# Altium schematic sheet Sheet1.SchDoc
size A1
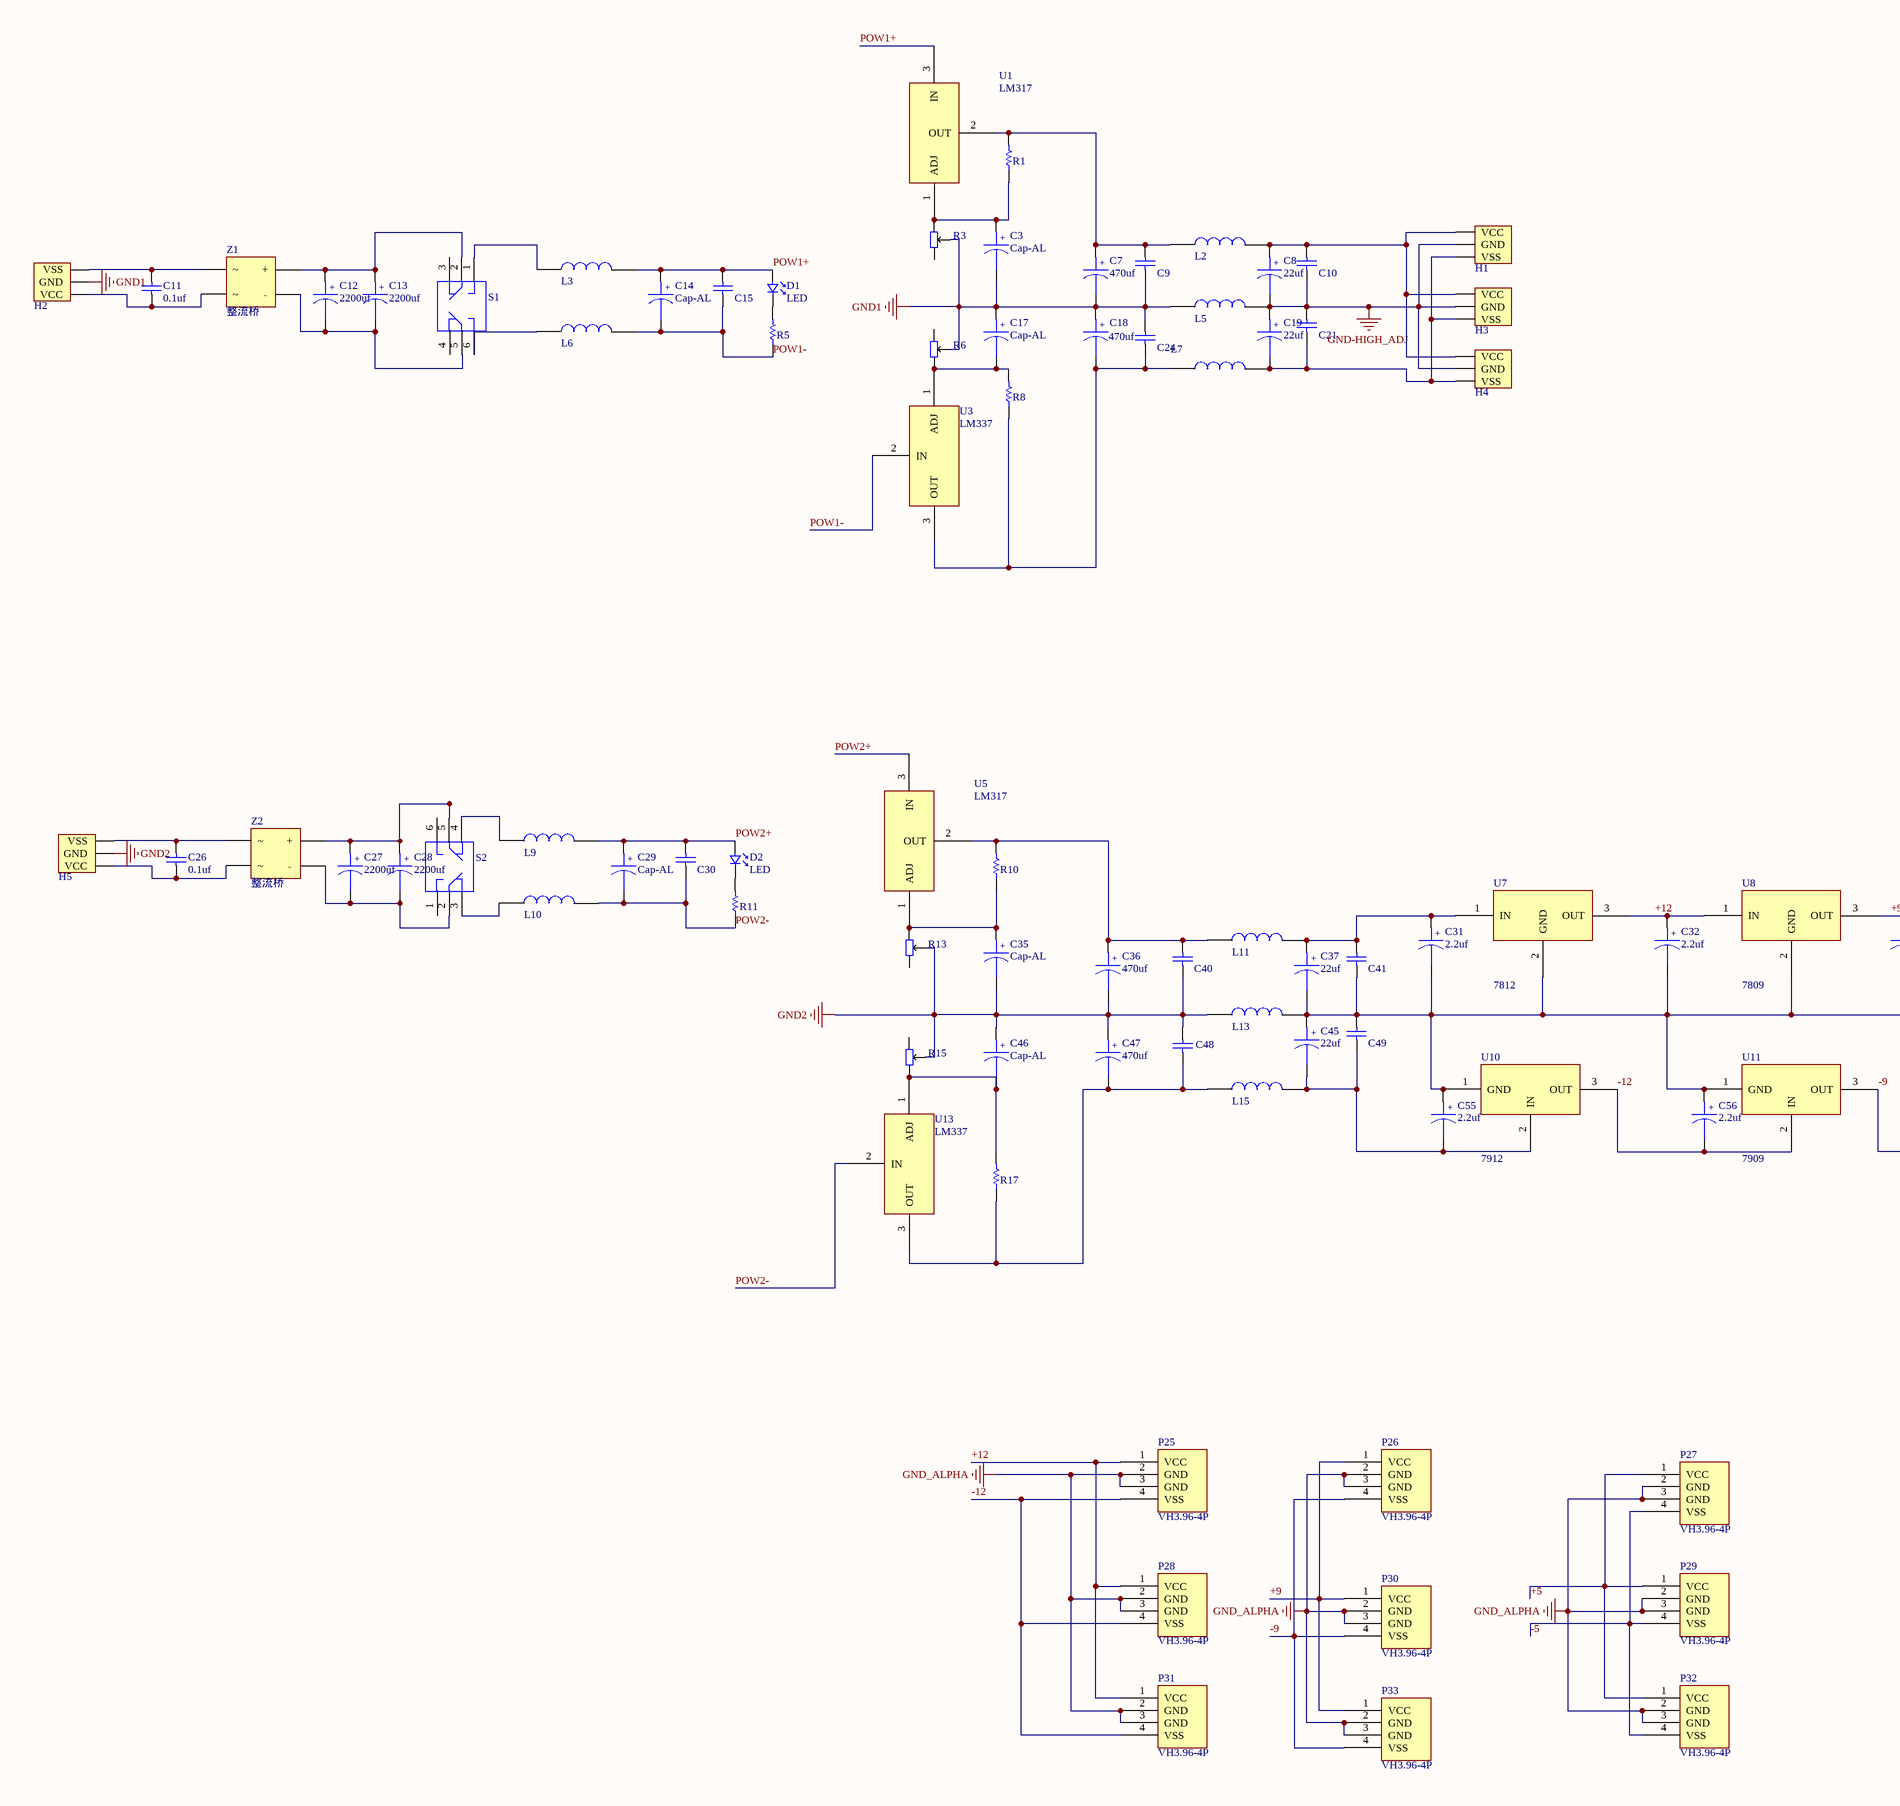
[diagram p0: Sheet1.SchDoc, left]
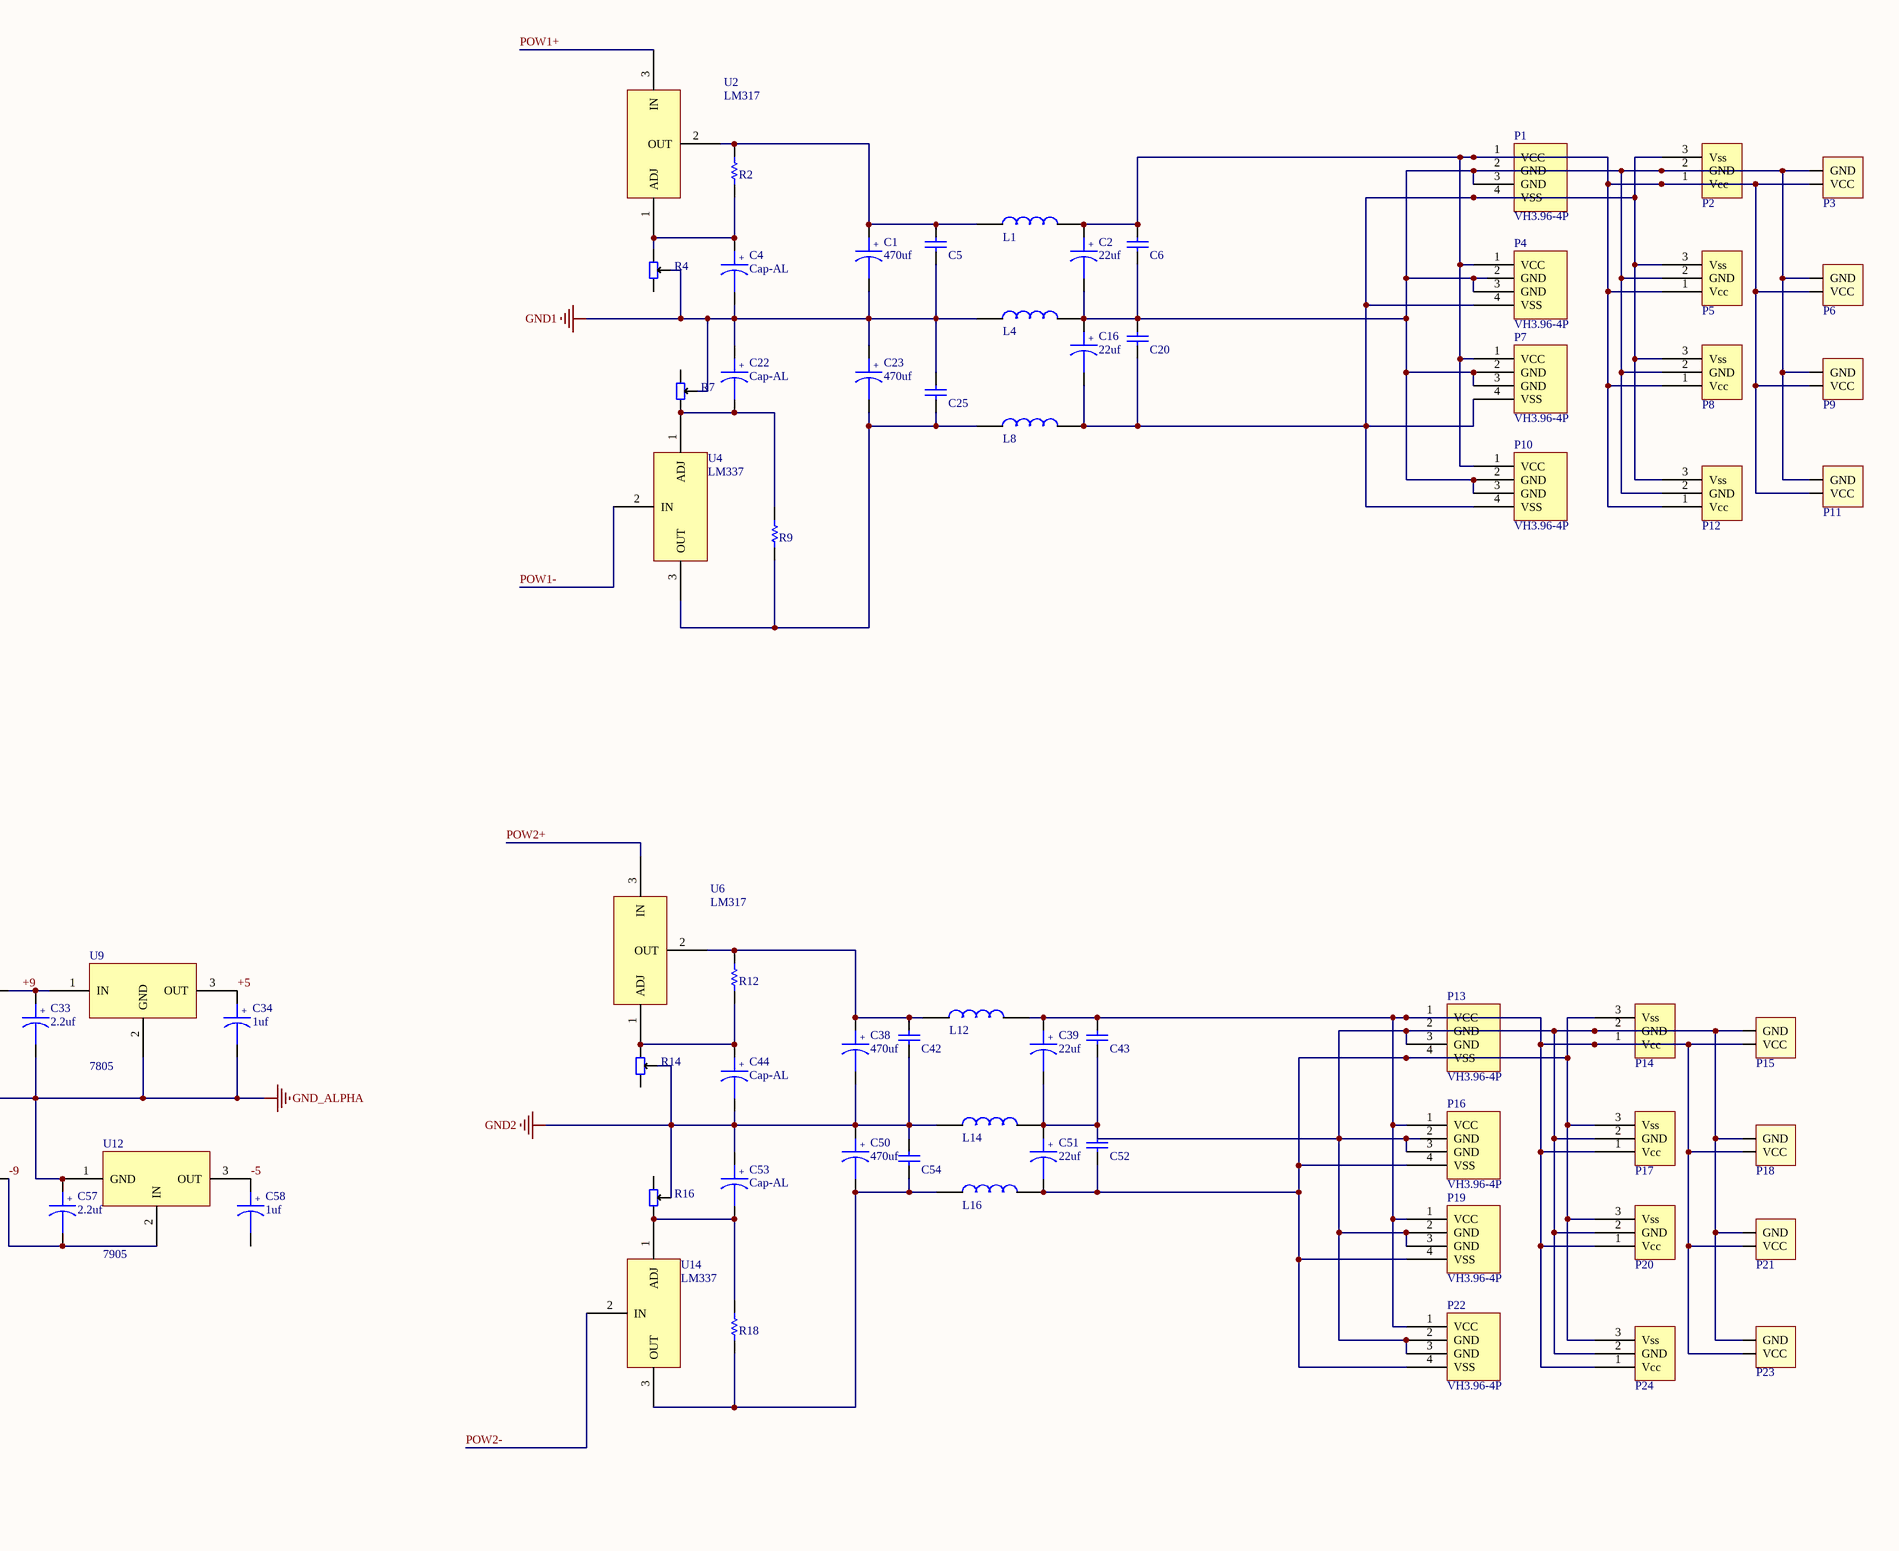
[diagram p1: Sheet1.SchDoc, right]

## Parts
C1  470uf  [CD-5mm]
C2  22uf  [CD-3mm]
C3  Cap-AL  [CD-2.2mm]
C4  Cap-AL  [CD-2.2mm]
C5  Cap-SEMI  [独石电容]  (value not drawn)
C6  Cap-SEMI  [独石电容]  (value not drawn)
C7  470uf  [CD-5mm]
C8  22uf  [CD-3mm]
C9  Cap-SEMI  [独石电容]  (value not drawn)
C10  Cap-SEMI  [独石电容]  (value not drawn)
C11  值: 0.1uf  [安规电容]  (hidden comment: Cap1)
C12  2200uf  [CD-7.6mm]
C13  2200uf  [CD-7.6mm]
C14  Cap-AL  [CD-3mm]
C15  0.1uf  [独石电容]  (value not drawn)
C16  22uf  [CD-3mm]
C17  Cap-AL  [CD-2.2mm]
C18  470uf  [CD-5mm]
C19  22uf  [CD-3mm]
C20  Cap-SEMI  [独石电容]  (value not drawn)
C21  Cap-SEMI  [独石电容]  (value not drawn)
C22  Cap-AL  [CD-2.2mm]
C23  470uf  [CD-5mm]
C24  Cap-SEMI  [独石电容]  (value not drawn)
C25  Cap-SEMI  [独石电容]  (value not drawn)
C26  值: 0.1uf  [安规电容]  (hidden comment: Cap1)
C27  2200uf  [CD-7.6mm]
C28  2200uf  [CD-7.6mm]
C29  Cap-AL  [CD-3mm]
C30  0.1uf  [独石电容]  (value not drawn)
C31  2.2uf  [CD-2.2mm]
C32  2.2uf  [CD-2.2mm]
C33  2.2uf  [CD-2.2mm]
C34  1uf  [CD-2.2mm]
C35  Cap-AL  [CD-2.2mm]
C36  470uf  [CD-5mm]
C37  22uf  [CD-3mm]
C38  470uf  [CD-5mm]
C39  22uf  [CD-3mm]
C40  Cap-SEMI  [独石电容]  (value not drawn)
C41  Cap-SEMI  [独石电容]  (value not drawn)
C42  Cap-SEMI  [独石电容]  (value not drawn)
C43  Cap-SEMI  [独石电容]  (value not drawn)
C44  Cap-AL  [CD-2.2mm]
C45  22uf  [CD-3mm]
C46  Cap-AL  [CD-2.2mm]
C47  470uf  [CD-5mm]
C48  Cap-SEMI  [独石电容]  (value not drawn)
C49  Cap-SEMI  [独石电容]  (value not drawn)
C50  470uf  [CD-5mm]
C51  22uf  [CD-3mm]
C52  Cap-SEMI  [独石电容]  (value not drawn)
C53  Cap-AL  [CD-2.2mm]
C54  Cap-SEMI  [独石电容]  (value not drawn)
C55  2.2uf  [CD-2.2mm]
C56  2.2uf  [CD-2.2mm]
C57  2.2uf  [CD-2.2mm]
C58  1uf  [CD-2.2mm]
D1  LED  [0805_s]
D2  LED  [0805_s]
H1  KF128-5.08-3P  [KF128-5.08-3P]  (value not drawn)
H2  KF128-5.08-3P  [KF128-5.08-3P]  (value not drawn)
H3  KF128-5.08-3P  [KF128-5.08-3P]  (value not drawn)
H4  KF128-5.08-3P  [KF128-5.08-3P]  (value not drawn)
H5  KF128-5.08-3P  [KF128-5.08-3P]  (value not drawn)
L1  SMD  [功率电感-12x12 - duplicate]  (value not drawn)
L2  SMD  [功率电感-12x12 - duplicate]  (value not drawn)
L3  SMD  [功率电感-12x12 - duplicate]  (value not drawn)
L4  SMD  [功率电感-12x12 - duplicate]  (value not drawn)
L5  SMD  [功率电感-12x12 - duplicate]  (value not drawn)
L6  SMD  [功率电感-12x12 - duplicate]  (value not drawn)
L7  SMD  [功率电感-12x12 - duplicate]  (value not drawn)
L8  SMD  [功率电感-12x12 - duplicate]  (value not drawn)
L9  SMD  [功率电感-12x12 - duplicate]  (value not drawn)
L10  SMD  [功率电感-12x12 - duplicate]  (value not drawn)
L11  SMD  [功率电感-12x12 - duplicate]  (value not drawn)
L12  SMD  [功率电感-12x12 - duplicate]  (value not drawn)
L13  SMD  [功率电感-12x12 - duplicate]  (value not drawn)
L14  SMD  [功率电感-12x12 - duplicate]  (value not drawn)
L15  SMD  [功率电感-12x12 - duplicate]  (value not drawn)
L16  SMD  [功率电感-12x12 - duplicate]  (value not drawn)
P1  VH3.96-4P  [VH3.96-4P]
P2  XH2.54-3p  [XH2.54-3p]  (value not drawn)
P3  Power_2Port  [Power_S_2Port]  (value not drawn)
P4  VH3.96-4P  [VH3.96-4P]
P5  XH2.54-3p  [XH2.54-3p]  (value not drawn)
P6  Power_2Port  [Power_S_2Port]  (value not drawn)
P7  VH3.96-4P  [VH3.96-4P]
P8  XH2.54-3p  [XH2.54-3p]  (value not drawn)
P9  Power_2Port  [Power_S_2Port]  (value not drawn)
P10  VH3.96-4P  [VH3.96-4P]
P11  Power_2Port  [Power_S_2Port]  (value not drawn)
P12  XH2.54-3p  [XH2.54-3p]  (value not drawn)
P13  VH3.96-4P  [VH3.96-4P]
P14  XH2.54-3p  [XH2.54-3p]  (value not drawn)
P15  Power_2Port  [Power_S_2Port]  (value not drawn)
P16  VH3.96-4P  [VH3.96-4P]
P17  XH2.54-3p  [XH2.54-3p]  (value not drawn)
P18  Power_2Port  [Power_S_2Port]  (value not drawn)
P19  VH3.96-4P  [VH3.96-4P]
P20  XH2.54-3p  [XH2.54-3p]  (value not drawn)
P21  Power_2Port  [Power_S_2Port]  (value not drawn)
P22  VH3.96-4P  [VH3.96-4P]
P23  Power_2Port  [Power_S_2Port]  (value not drawn)
P24  XH2.54-3p  [XH2.54-3p]  (value not drawn)
P25  VH3.96-4P  [VH3.96-4P]
P26  VH3.96-4P  [VH3.96-4P]
P27  VH3.96-4P  [VH3.96-4P]
P28  VH3.96-4P  [VH3.96-4P]
P29  VH3.96-4P  [VH3.96-4P]
P30  VH3.96-4P  [VH3.96-4P]
P31  VH3.96-4P  [VH3.96-4P]
P32  VH3.96-4P  [VH3.96-4P]
P33  VH3.96-4P  [VH3.96-4P]
R1  RES  [0805]  (value not drawn)
R2  RES  [0805]  (value not drawn)
R3  可调电位器1  [电位器]  (value not drawn)
R4  可调电位器1  [电位器]  (value not drawn)
R5  RES  [0805]  (value not drawn)
R6  可调电位器1  [电位器]  (value not drawn)
R7  可调电位器1  [电位器]  (value not drawn)
R8  RES  [0805]  (value not drawn)
R9  RES  [0805]  (value not drawn)
R10  RES  [0805]  (value not drawn)
R11  RES  [0805]  (value not drawn)
R12  RES  [0805]  (value not drawn)
R13  可调电位器1  [电位器]  (value not drawn)
R14  可调电位器1  [电位器]  (value not drawn)
R15  可调电位器1  [电位器]  (value not drawn)
R16  可调电位器1  [电位器]  (value not drawn)
R17  RES  [0805]  (value not drawn)
R18  RES  [0805]  (value not drawn)
S1  双掷开关  [SWITCH]  (value not drawn)
S2  双掷开关  [SWITCH]  (value not drawn)
U1  LM317  [TO-220]
U2  LM317  [TO-220]
U3  LM337  [TO-220]
U4  LM337  [TO-220]
U5  LM317  [TO-220]
U6  LM317  [TO-220]
U7  7812  [TO-220]
U8  7809  [TO-220]
U9  7805  [TO-220]
U10  7912  [TO-220]
U11  7909  [TO-220]
U12  7905  [TO-220]
U13  LM337  [TO-220]
U14  LM337  [TO-220]
Z1  整流桥  [整流桥]
Z2  整流桥  [整流桥]

## Nets
GND1: C1.2 C3.2 C4.2 C5.1 C7.2 C9.1 C17.1 C18.1 C22.1 C23.1 C24.2 C25.2 H2.2(GND) L4.1 L5.1 R3.2 R4.2 R6.2 R7.2
GND2: C35.2 C36.2 C38.2 C40.1 C42.1 C44.2 C46.1 C47.1 C48.2 C50.1 C53.1 C54.2 H5.2(GND) L13.1 L14.1 R13.2 R14.2 R15.2 R16.2
GND-HIGH_ADJ: C8.2 C10.1 C19.1 C21.2 H1.2(GND) H3.2(GND) H4.2(GND) L5.2
GND_ALPHA: C31.2 C32.2 C33.2 C34.2 C37.2 C41.1 C45.1 C49.2 C55.1 C56.1 C57.1 L13.2 P25.2(GND) P25.3(GND) P26.2(GND) P26.3(GND) P27.2(GND) P27.3(GND) P28.2(GND) P28.3(GND) P29.2(GND) P29.3(GND) P30.2(GND) P30.3(GND) P31.2(GND) P31.3(GND) P32.2(GND) P32.3(GND) P33.2(GND) P33.3(GND) U7.2(GND) U8.2(GND) U9.2(GND) U10.1(GND) U11.1(GND) U12.1(GND)
+5: C34.1 P27.1(VCC) P29.1(VCC) P32.1(VCC) U9.3(OUT)
+9: C33.1 P26.1(VCC) P30.1(VCC) P33.1(VCC) U8.3(OUT) U9.1(IN)
+12: C32.1 P25.1(VCC) P28.1(VCC) P31.1(VCC) U7.3(OUT) U8.1(IN)
-5: C58.1 P27.4(VSS) P29.4(VSS) P32.4(VSS) U12.3(OUT)
-9: C57.2 P26.4(VSS) P30.4(VSS) P33.4(VSS) U11.3(OUT) U12.2(IN)
-12: C56.2 P25.4(VSS) P28.4(VSS) P31.4(VSS) U10.3(OUT) U11.2(IN)
POW1+: C14.1 C15.2 D1.2 L3.2 U1.3(IN) U2.3(IN)
POW1-: C14.2 C15.1 L6.2 R5.1 U3.2(IN) U4.2(IN)
POW2+: C29.1 C30.2 D2.2 L9.2 U5.3(IN) U6.3(IN)
POW2-: C29.2 C30.1 L10.2 R11.1 U13.2(IN) U14.2(IN)
NetC1_1: C1.1 C5.2 L1.1 R2.2 U2.2(OUT)
NetC2_1: C2.1 C6.2 L1.2 P1.1(VCC) P2.1(Vcc) P3.1(VCC) P4.1(VCC) P5.1(Vcc) P6.1(VCC) P7.1(VCC) P8.1(Vcc) P9.1(VCC) P10.1(VCC) P11.1(VCC) P12.1(Vcc)
NetC2_2: C2.2 C6.1 C16.1 C20.2 L4.2 P1.2(GND) P1.3(GND) P2.2(GND) P3.2(GND) P4.2(GND) P4.3(GND) P5.2(GND) P6.2(GND) P7.2(GND) P7.3(GND) P8.2(GND) P9.2(GND) P10.2(GND) P10.3(GND) P11.2(GND) P12.2(GND)
NetC3_1: C3.1 R1.1 R3.3 U1.1(ADJ)
NetC4_1: C4.1 R2.1 R4.3 U2.1(ADJ)
NetC7_1: C7.1 C9.2 L2.1 R1.2 U1.2(OUT)
NetC8_1: C8.1 C10.2 H1.1(VCC) H3.1(VCC) H4.1(VCC) L2.2
NetC11_1: C11.1 H2.1(VCC) Z1.3
NetC11_2: C11.2 H2.3(VSS) Z1.2
NetC12_1: C12.1 C13.1 S1.2 Z1.1(+)
NetC12_2: C12.2 C13.2 S1.5 Z1.4(﹣)
NetC16_2: C16.2 C20.1 L8.2 P1.4(VSS) P2.3(Vss) P4.4(VSS) P5.3(Vss) P7.4(VSS) P8.3(Vss) P10.4(VSS) P12.3(Vss)
NetC17_2: C17.2 R6.1 R8.2 U3.1(ADJ)
NetC18_2: C18.2 C24.1 L7.1 R8.1 U3.3(OUT)
NetC19_2: C19.2 C21.1 H1.3(VSS) H3.3(VSS) H4.3(VSS) L7.2
NetC22_2: C22.2 R7.1 R9.2 U4.1(ADJ)
NetC23_2: C23.2 C25.1 L8.1 R9.1 U4.3(OUT)
NetC26_1: C26.1 H5.1(VCC) Z2.3
NetC26_2: C26.2 H5.3(VSS) Z2.2
NetC27_1: C27.1 C28.1 S2.5 Z2.1(+)
NetC27_2: C27.2 C28.2 S2.2 Z2.4(﹣)
NetC31_1: C31.1 C37.1 C41.2 L11.2 U7.1(IN)
NetC35_1: C35.1 R10.1 R13.3 U5.1(ADJ)
NetC36_1: C36.1 C40.2 L11.1 R10.2 U5.2(OUT)
NetC38_1: C38.1 C42.2 L12.1 R12.2 U6.2(OUT)
NetC39_1: C39.1 C43.2 L12.2 P13.1(VCC) P14.1(Vcc) P15.1(VCC) P16.1(VCC) P17.1(Vcc) P18.1(VCC) P19.1(VCC) P20.1(Vcc) P21.1(VCC) P22.1(VCC) P23.1(VCC) P24.1(Vcc)
NetC39_2: C39.2 C43.1 C51.1 C52.2 L14.2 P13.2(GND) P13.3(GND) P14.2(GND) P15.2(GND) P16.2(GND) P16.3(GND) P17.2(GND) P18.2(GND) P19.2(GND) P19.3(GND) P20.2(GND) P21.2(GND) P22.2(GND) P22.3(GND) P23.2(GND) P24.2(GND)
NetC44_1: C44.1 R12.1 R14.3 U6.1(ADJ)
NetC45_2: C45.2 C49.1 C55.2 L15.2 U10.2(IN)
NetC46_2: C46.2 R15.1 R17.2 U13.1(ADJ)
NetC47_2: C47.2 C48.1 L15.1 R17.1 U13.3(OUT)
NetC50_2: C50.2 C54.1 L16.1 R18.1 U14.3(OUT)
NetC51_2: C51.2 C52.1 L16.2 P13.4(VSS) P14.3(Vss) P16.4(VSS) P17.3(Vss) P19.4(VSS) P20.3(Vss) P22.4(VSS) P24.3(Vss)
NetC53_2: C53.2 R16.1 R18.2 U14.1(ADJ)
NetD1_1: D1.1 R5.2
NetD2_1: D2.1 R11.2
NetL3_1: L3.1 S1.1
NetL6_1: L6.1 S1.6
NetL9_1: L9.1 S2.4
NetL10_1: L10.1 S2.3

Not connected (* = marked no-connect by the designer): C58 2; R3 1; R4 1; R6 3; R7 3; R13 1; R14 1; R15 3; R16 3; S1 3 4; S2 1 6

## Notes on the sheet
- (in symbol Cap) +
- (in symbol Cap-AL) +

## Library data of the parts
C1 C2 C7 C8 C16 C18 C19 C23 C31-C34 C36-C39 C45 C47 C50 C51 C55-C58 = Cap-AL
C12 C13 C27 C28 = Cap
C15 C30 = Cap-SEMI
L1-L16 = 功率电感
R1 R2 R5 R8-R12 R17 R18 = RES: 值: 1k
U7-U9 = 78XX
U10-U12 = 79XX